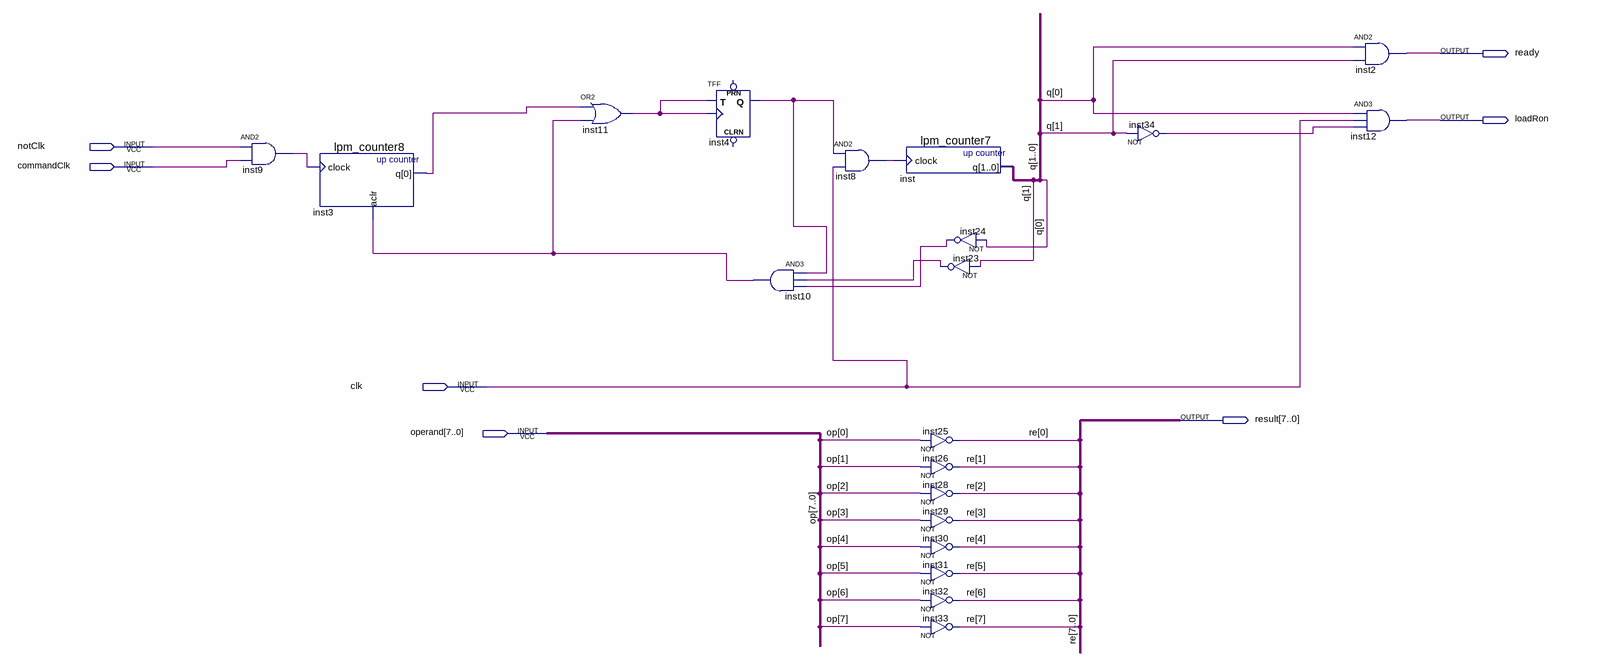
[diagram p0: schematic sheet]
// Quartus schematic NOTOperation.bdf as structural Verilog: 20 symbols, 7 pins
module NOTOperation (
  input  notClk,
  input  commandClk,
  input  clk,
  input  [7:0] operand,
  output ready,
  output loadRon,
  output [7:0] result
);

  wire inst3_q, inst4_q, inst8_out, inst9_out, inst10_out, inst11_out, inst23_out, inst24_out, inst34_out;
  wire [1:0] q;

  and inst9 (inst9_out, notClk, commandClk);
  lpm_counter8 inst3 (.clock(inst9_out), .aclr(inst10_out), .q(inst3_q));
  or inst11 (inst11_out, inst3_q, inst10_out);
  TFF inst4 (.T(inst11_out), .CLK(inst11_out), .Q(inst4_q));  // open: PRN, CLRN
  and inst10 (inst10_out, inst4_q, inst23_out, inst24_out);
  and inst8 (inst8_out, inst4_q, clk);
  lpm_counter7 inst (.clock(inst8_out), .q(q));
  not inst23 (inst23_out, q[1]);
  not inst25 (result[0], operand[0]);
  not inst26 (result[1], operand[1]);
  not inst28 (result[2], operand[2]);
  not inst29 (result[3], operand[3]);
  not inst30 (result[4], operand[4]);
  not inst31 (result[5], operand[5]);
  not inst32 (result[6], operand[6]);
  not inst33 (result[7], operand[7]);
  not inst24 (inst24_out, q[0]);
  not inst34 (inst34_out, q[1]);
  and inst2 (ready, q[0], q[1]);
  and inst12 (loadRon, q[0], clk, inst34_out);

  // Other names for the same wires on the sheet: op[7:0] = operand; re[7:0] = result
endmodule
